# EAGLE design REALcontrol_boardv22 (EAGLE 9.6.2)
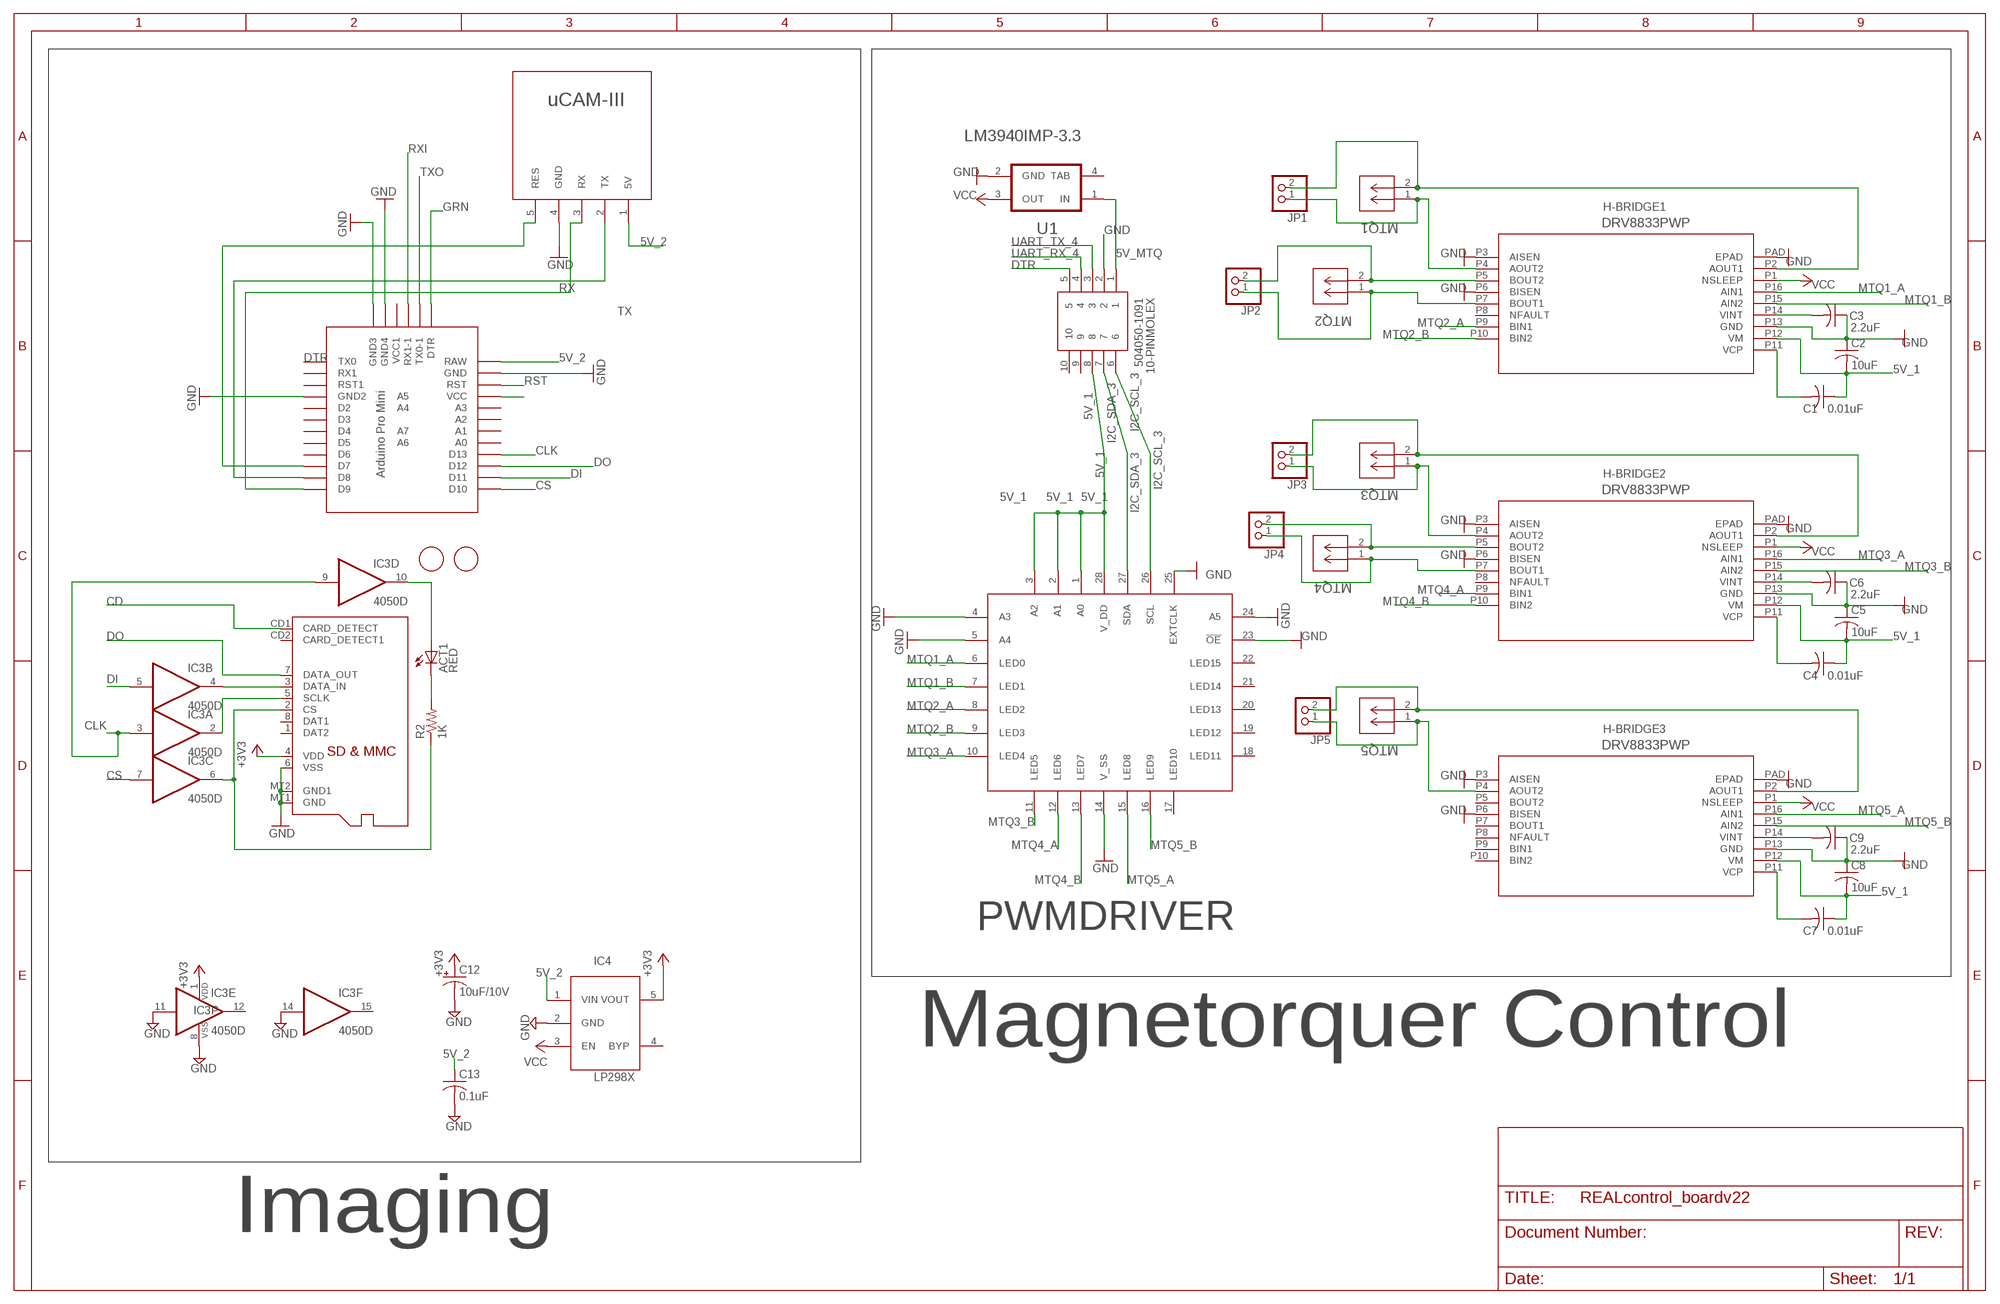
[diagram p0: schematic, sheet 1]

## Parts
10-PINMOLEX  504050-1091  [504050-1091]
ACT1  RED  LEDCHIP-LED0805  [CHIP-LED0805]
C1  0.01uF  C-USC0603K  [C0603K]
C2  10uF  C-USC1210K  [C1210K]
C3  2.2uF  C-USC0603K  [C0603K]
C4  0.01uF  C-USC0603K  [C0603K]
C5  10uF  C-USC1210K  [C1210K]
C6  2.2uF  C-USC0603K  [C0603K]
C7  0.01uF  C-USC0603K  [C0603K]
C8  10uF  C-USC1210K  [C1210K]
C9  2.2uF  C-USC0603K  [C0603K]
C12  10uF/10V  CPOL-USA/3216-18R  [A/3216-18R]
C13  0.1uF  C-USC0805K  [C0805K]
H-BRIDGE1  DRV8833PWP  [HTSSOP16]
H-BRIDGE2  DRV8833PWP  [HTSSOP16]
H-BRIDGE3  DRV8833PWP  [HTSSOP16]
IC3  4050D  [SO16]
IC4  LP298XS  [SOT23-5L]
JP1  PINHD-1X2  [1X02]
JP2  PINHD-1X2  [1X02]
JP3  PINHD-1X2  [1X02]
JP4  PINHD-1X2  [1X02]
JP5  PINHD-1X2  [1X02]
MTQ1  DF13C-2P-1.25V(51)  [CON2_1X2_U_DF13]
MTQ2  DF13C-2P-1.25V(51)  [CON2_1X2_U_DF13]
MTQ3  DF13C-2P-1.25V(51)  [CON2_1X2_U_DF13]
MTQ4  DF13C-2P-1.25V(51)  [CON2_1X2_U_DF13]
MTQ5  DF13C-2P-1.25V(51)  [CON2_1X2_U_DF13]
PWMDRIVER  PCA9685PW  [TSSOP28]
R2  1K  R-US_R0805  [R0805]
U1  TI_NATIONAL_SEMICONDUCTOR_LM3940IMP-3.3TI_NATIONAL_SEMICONDUCTOR_LM3940IMP-3.3_0_1  [TI_NATIONAL_SEMICONDUCTOR_LM3940IMP-3.3_1]
U$2  UCAM-III  [UCAM-III]
U$6  FIDUCIAL  [FIDUCIAL_1MM]
U$7  FIDUCIAL  [FIDUCIAL_1MM]
U$8  PRO-MINI-2  [PRO-MINI-2]
X2  MICROSD  [MICROSD]

## Nets
5V_1 [New Class]: 10-PINMOLEX.8 C1.1 C2.2 C4.1 C5.2 C7.1 C8.2 H-BRIDGE1.P12(VM) H-BRIDGE2.P12(VM) H-BRIDGE3.P12(VM) PWMDRIVER.1(A0) PWMDRIVER.2(A1) PWMDRIVER.3(A2) PWMDRIVER.28(V_DD)
5V_2 [New Class]: C13.1 IC4.1(VIN) U$2.1(5V) U$8.RAW
5V_MTQ [New Class]: 10-PINMOLEX.1 U1.1(IN)
+3V3: C12.+ IC3.1(P:VDD) IC4.5(VOUT) X2.4(VDD)
CD: X2.CD1(CARD_DETECT)
CLK: IC3.3(A:I) IC3.9(D:I) U$8.D13
CS: IC3.7(C:I) U$8.D10
DI: IC3.5(B:I) U$8.D11
DO: U$8.D12 X2.7(DATA_OUT)
DTR: 10-PINMOLEX.5
GND [MTQs]: 10-PINMOLEX.2 C2.1 C3.1 C5.1 C6.1 C8.1 C9.1 C12.- C13.2 H-BRIDGE1.P3(AISEN) H-BRIDGE1.P6(BISEN) H-BRIDGE1.P13(GND) H-BRIDGE1.PAD(EPAD) H-BRIDGE2.P3(AISEN) H-BRIDGE2.P6(BISEN) H-BRIDGE2.P13(GND) H-BRIDGE2.PAD(EPAD) H-BRIDGE3.P3(AISEN) H-BRIDGE3.P6(BISEN) H-BRIDGE3.P13(GND) H-BRIDGE3.PAD(EPAD) IC3.8(P:VSS) IC3.11(E:I) IC3.14(F:I) IC4.2(GND) PWMDRIVER.4(A3) PWMDRIVER.5(A4) PWMDRIVER.14(V_SS) PWMDRIVER.23(!OE) PWMDRIVER.24(A5) PWMDRIVER.25(EXTCLK) U1.2(GND) U$2.4(GND) U$8.GND U$8.GND1(GND2) U$8.GND2(GND3) U$8.GND3(GND4) X2.6(VSS) X2.MT1(GND) X2.MT2(GND1)
GRN: U$8.DTR
I2C_SCL_3: 10-PINMOLEX.6 PWMDRIVER.26(SCL)
I2C_SDA_3: 10-PINMOLEX.7 PWMDRIVER.27(SDA)
MTQ1_A: H-BRIDGE1.P16(AIN1) PWMDRIVER.6(LED0)
MTQ1_B: H-BRIDGE1.P15(AIN2) PWMDRIVER.7(LED1)
MTQ2_A: H-BRIDGE1.P9(BIN1) PWMDRIVER.8(LED2)
MTQ2_B: H-BRIDGE1.P10(BIN2) PWMDRIVER.9(LED3)
MTQ3_A: H-BRIDGE2.P16(AIN1) PWMDRIVER.10(LED4)
MTQ3_B: H-BRIDGE2.P15(AIN2) PWMDRIVER.11(LED5)
MTQ4_A: H-BRIDGE2.P9(BIN1) PWMDRIVER.12(LED6)
MTQ4_B: H-BRIDGE2.P10(BIN2) PWMDRIVER.13(LED7)
MTQ5_A: H-BRIDGE3.P16(AIN1) PWMDRIVER.15(LED8)
MTQ5_B: H-BRIDGE3.P15(AIN2) PWMDRIVER.16(LED9)
N$1 [MTQs]: H-BRIDGE2.P2(AOUT1) JP3.2 MTQ3.2
N$2: C3.2 H-BRIDGE1.P14(VINT)
N$3 [MTQs]: H-BRIDGE1.P4(AOUT2) JP1.1 MTQ1.1
N$4 [MTQs]: H-BRIDGE1.P2(AOUT1) JP1.2 MTQ1.2
N$5 [MTQs]: H-BRIDGE1.P7(BOUT1) JP2.1 MTQ2.1
N$6 [MTQs]: H-BRIDGE1.P5(BOUT2) JP2.2 MTQ2.2
N$7: C1.2 H-BRIDGE1.P11(VCP)
N$8 [MTQs]: H-BRIDGE2.P7(BOUT1) JP4.1 MTQ4.1
N$9 [MTQs]: H-BRIDGE2.P5(BOUT2) JP4.2 MTQ4.2
N$10: C6.2 H-BRIDGE2.P14(VINT)
N$11: C4.2 H-BRIDGE2.P11(VCP)
N$12 [MTQs]: H-BRIDGE2.P4(AOUT2) JP3.1 MTQ3.1
N$13 [MTQs]: H-BRIDGE3.P2(AOUT1) JP5.2 MTQ5.2
N$16: C9.2 H-BRIDGE3.P14(VINT)
N$17: C7.2 H-BRIDGE3.P11(VCP)
N$18 [MTQs]: H-BRIDGE3.P4(AOUT2) JP5.1 MTQ5.1
N$21: U$8.VCC
N$22: ACT1.A IC3.10(D:O)
N$23: IC3.2(A:O) X2.5(SCLK)
N$24: IC3.6(C:O) R2.1 X2.2(CS)
N$25: ACT1.C R2.2
N$26: IC3.4(B:O) X2.3(DATA_IN)
N$27: U$2.5(RES) U$8.D7
RST: U$8.RST
RX: U$2.3(RX) U$8.D9
RXI: U$8.RX1-1
TX: U$2.2(TX) U$8.D8
TXO: U$8.TX0-1
UART_RX_4: 10-PINMOLEX.4
UART_TX_4: 10-PINMOLEX.3
VCC: H-BRIDGE1.P1(NSLEEP) H-BRIDGE2.P1(NSLEEP) H-BRIDGE3.P1(NSLEEP) IC4.3(EN) U1.3(OUT)
Unconnected: 10-PINMOLEX.9 10-PINMOLEX.10 H-BRIDGE1.P8(NFAULT) H-BRIDGE2.P8(NFAULT) H-BRIDGE3.P5(BOUT2) H-BRIDGE3.P7(BOUT1) H-BRIDGE3.P8(NFAULT) H-BRIDGE3.P9(BIN1) H-BRIDGE3.P10(BIN2) IC3.12(E:O) IC3.15(F:O) IC4.4(BYP) PWMDRIVER.17(LED10) PWMDRIVER.18(LED11) PWMDRIVER.19(LED12) PWMDRIVER.20(LED13) PWMDRIVER.21(LED14) PWMDRIVER.22(LED15) U$8.A0 U$8.A1 U$8.A2 U$8.A3 U$8.A4 U$8.A5 U$8.A6 U$8.A7 U$8.D2 U$8.D3 U$8.D4 U$8.D5 U$8.D6 U$8.RST1 U$8.RX1 U$8.TX0 U$8.VCC1 X2.1(DAT2) X2.8(DAT1) X2.CD2(CARD_DETECT1)

## Notes on the sheet
- Magnetorquer Control
- Imaging

## Power pins joined to a net without a drawn wire
TAB: U1.4(TAB)

## Library data of the parts
10-PINMOLEX = molex_10pin:504050-1091: Pico-Lock SMT Wire-to-Board Header 10way Molex 504050 Series, 1.5mm Pitch 10 Way 1 Row Right Angle PCB Header, SMT Termination, 3A Source: Datasheet <https://componentsearchengine.com/Datasheets/1/504050-1091.pdf>; DESCRIPTION: Pico-Lock SMT Wire-to-Board Header 10way Molex 504050 Series, 1.5mm Pitch 10 Way 1 Row Right Angle PCB Header, SMT Termination, 3A; HEIGHT: mm; MANUFACTURER_NAME: Molex; MANUFACTURER_PART_NUMBER: 504050-1091; MOUSER_PART_NUMBER: 538-504050-1091; MOUSER_PRICE-STOCK: https://www.mouser.com/Search/Refine.aspx?Keyword=538-504050-1091; OC_NEWARK: unknown
ACT1 = adafruit:LED: LED OSRAM: - CHIPLED LG R971, LG N971, LY N971, LG Q971, LY Q971, LO R971, LY R971 LH N974, LH R974 LS Q976, LO Q976, LY Q976 LO Q996 - Hyper CHIPLED LW Q18S LB Q993, LB Q99A, LB R99A - SideLED LS A670, LO A670, LY A670, LG A670, LP A670 LB A673, LV A673, LT A673, LW A673 LH A674 LY A675 LS A676, LA A676, LO A676, LY A676, LW A676 LS A679, LY A679, LG A679 - Hyper Micro SIDELED® LS Y876, LA Y876, LO Y876, LY Y876 LT Y87S - SmartLED LW L88C, LW L88S LB L89C, LB L89S, LG L890 LS L89K, LO L89K, LY L89K LS L896, LA L896, LO L896, LY L896 - TOPLED LS T670, LO T670, LY T670, LG T670, LP T670 LSG T670, LSP T670, LSY T670, LOP T670, LYG T670 LG T671, LOG T671, LSG T671 LB T673, LV T673, LT T673, LW T673 LH T674 LS T676, LA T676, LO T676, LY T676, LB T676, LH T676, LSB T676, LW T676 LB T67C, LV T67C, LT T67C, LS T67K, LO T67K, LY T67K, LW E67C LS E67B, LA E67B, LO E67B, LY E67B, LB E67C, LV E67C, LT E67C LW T67C LS T679, LY T679, LG T679 LS T770, LO T770, LY T770, LG T770, LP T770 LB T773, LV T773, LT T773, LW T773 LH T774 LS E675, LA E675, LY E675, LS T675 LS T776, LA T776, LO T776, LY T776, LB T776 LHGB T686 LT T68C, LB T68C - Hyper Mini TOPLED® LB M676 - Mini TOPLED Santana® LG M470 LS M47K, LO M47K, LY M47K Source: http://www.osram.convergy.de/; OC_NEWARK: unknown
C1-C9 = rcl:C-US: CAPACITOR, American symbol; OC_NEWARK: unknown; SPICEPREFIX: C
C12 = adafruit:CPOL-US: POLARIZED CAPACITOR, American symbol; OC_NEWARK: unknown
C13 = adafruit:C-US: CAPACITOR, American symbol; OC_NEWARK: unknown
H-BRIDGE1-H-BRIDGE3 = myparts:DRV8833PWP; OC_NEWARK: unknown
IC3 = 40xx:4050: Hex non-inverting BUFFER; OC_NEWARK: unknown
IC4 = adafruit:LP298X; OC_NEWARK: unknown
JP1-JP5 = pinhead:PINHD-1X2: PIN HEADER; MF: MOLEX; MPN: 22-11-2022; OC_NEWARK: 55H9825
MTQ1-MTQ5 = myparts:DF13C-2P-1.25V(51); BUILT_BY: EMA_UL_Team; MANUFACTURER_PART_NUMBER: DF13C-2P-1.25V(51); OC_NEWARK: unknown; VENDOR: Hirose
PWMDRIVER = myparts:PCA9685PW; OC_NEWARK: unknown
R2 = adafruit:R-US_: RESISTOR, American symbol; OC_NEWARK: unknown
U1 = TI National Semiconductor - LM3940IMP-3.3:TI_NATIONAL_SEMICONDUCTOR_LM3940IMP-3.3: PM-REG-LM2940-TO4; CIIVA_IDS: 1170636; CODE__IPC: SOT223-4; CODE__JEDEC: TO-261-AA; COMPONENT_LINK_1_DESCRIPTION: Datasheet URL; COMPONENT_LINK_1_URL: http://www.ti.com/general/docs/lit/getliterature.tsp?genericPartNumber=LM3940&fileType=pdf; COMP_TYPE: LDO IC; FOOTPRINT_VARIANT_NAME_0: Level C; FOOTPRINT_VARIANT_NAME_1: Level B; FOOTPRINT_VARIANT_NAME_2: Level A; IMPORTED: yes; IMPORTED_FROM: vault; IMPORT_TS: 1521848719; MF: TI National Semiconductor; MPN: LM3940IMP-3.3; PACKAGE: DCY0004A; PACKAGE_DESCRIPTION: Molded SOT-223, 6.50 x 3.56 x 1.6mm Body, 4 Lead, 2.3mm Pitch; PACKAGE_TOP_MARKING: XYTT*L52B; PIN_COUNT: 4; POWER_WISE: N; PREFIX: U; RELEASE_DATE: 1464091660; ROHS: No; VAULT_GUID: 7D174BE9-4519-4BE6-B3E4-802F171613CA; VAULT_REVISION: 33897558-4D8B-46BE-97DA-B950EC492A4C
U$2 = myparts:UCAM-III; OC_NEWARK: unknown
U$6 U$7 = adafruit:FIDUCIAL: For use by pick and place machines to calibrate the vision/machine, 1mm By microbuilder.eu; OC_NEWARK: unknown
U$8 = myparts:PRO-MINI-2: Arduino Pro Mini Layout 2 Sparkfun.com; OC_NEWARK: unknown
X2 = adafruit:MICROSD: Micro-SD / Transflash card holder with SPI pinout For the 3M # 2908-05WB-MG and/or 4UCON #19656 push-push type; OC_NEWARK: unknown

## Net classes
0 default: width 0.152 mm
1 New Class: width 0.457 mm
2 MTQs: width 0.305 mm

## Board
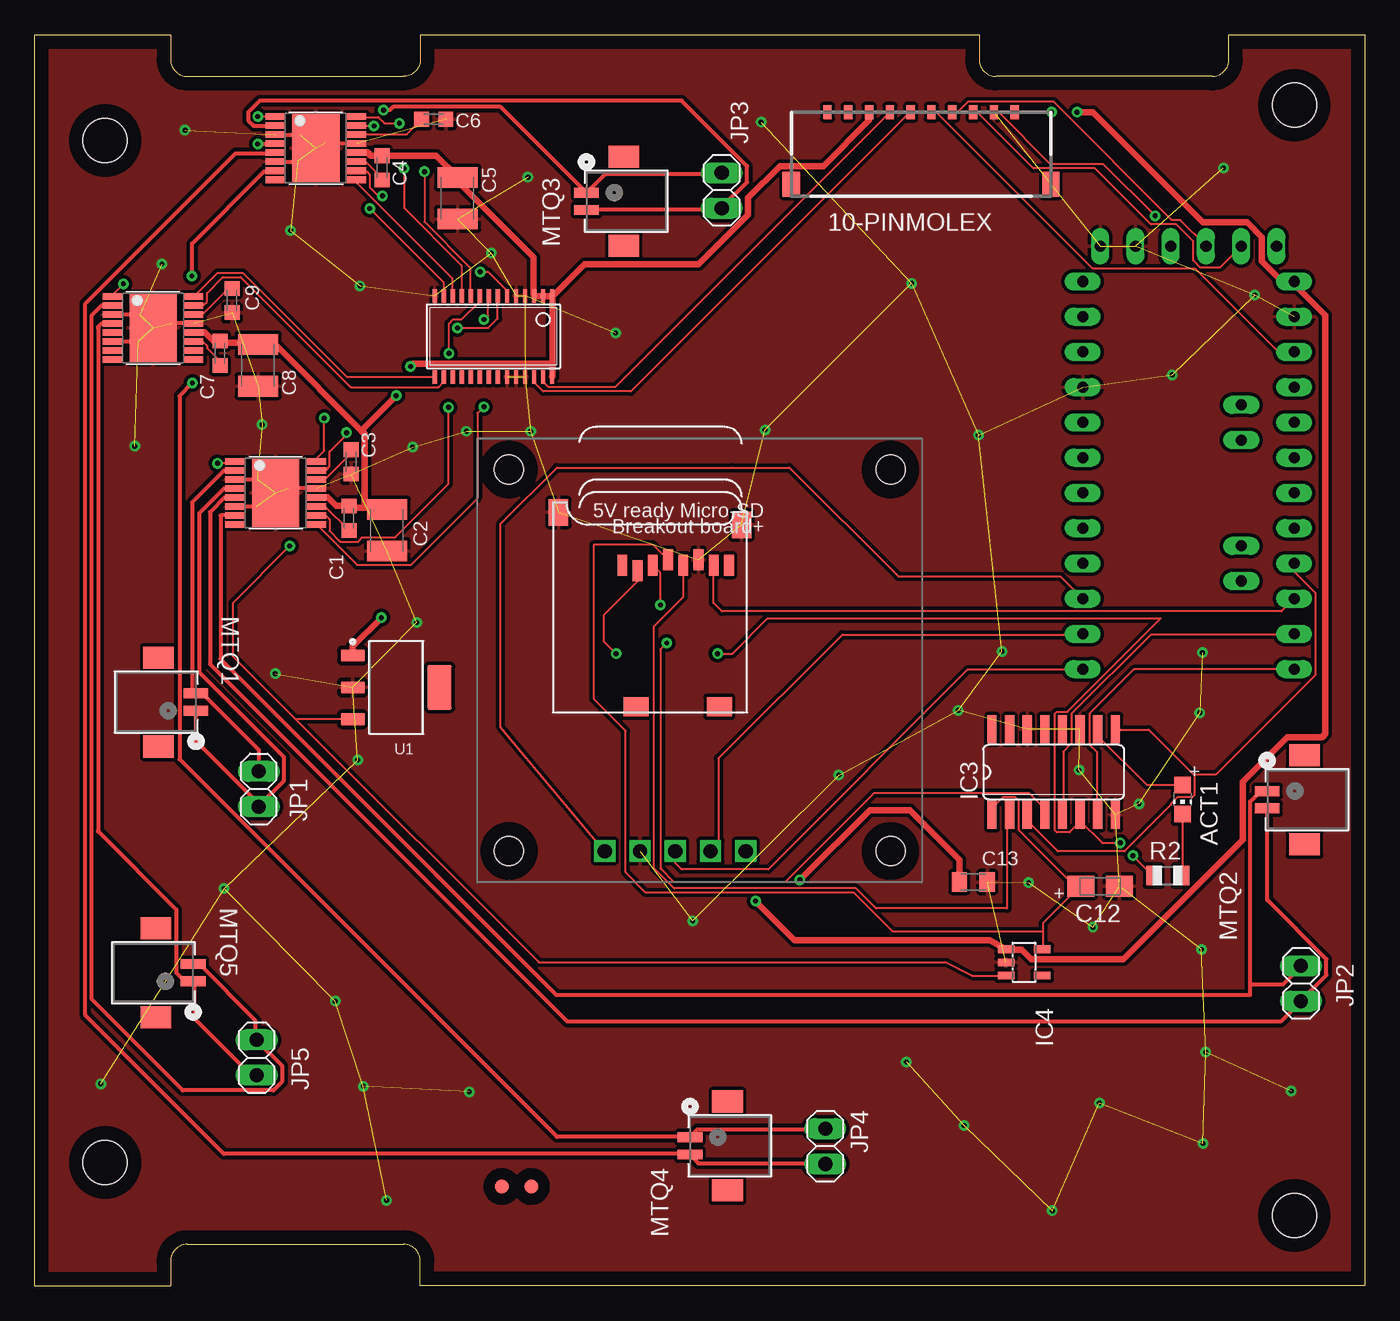
[diagram p1: board, top side]
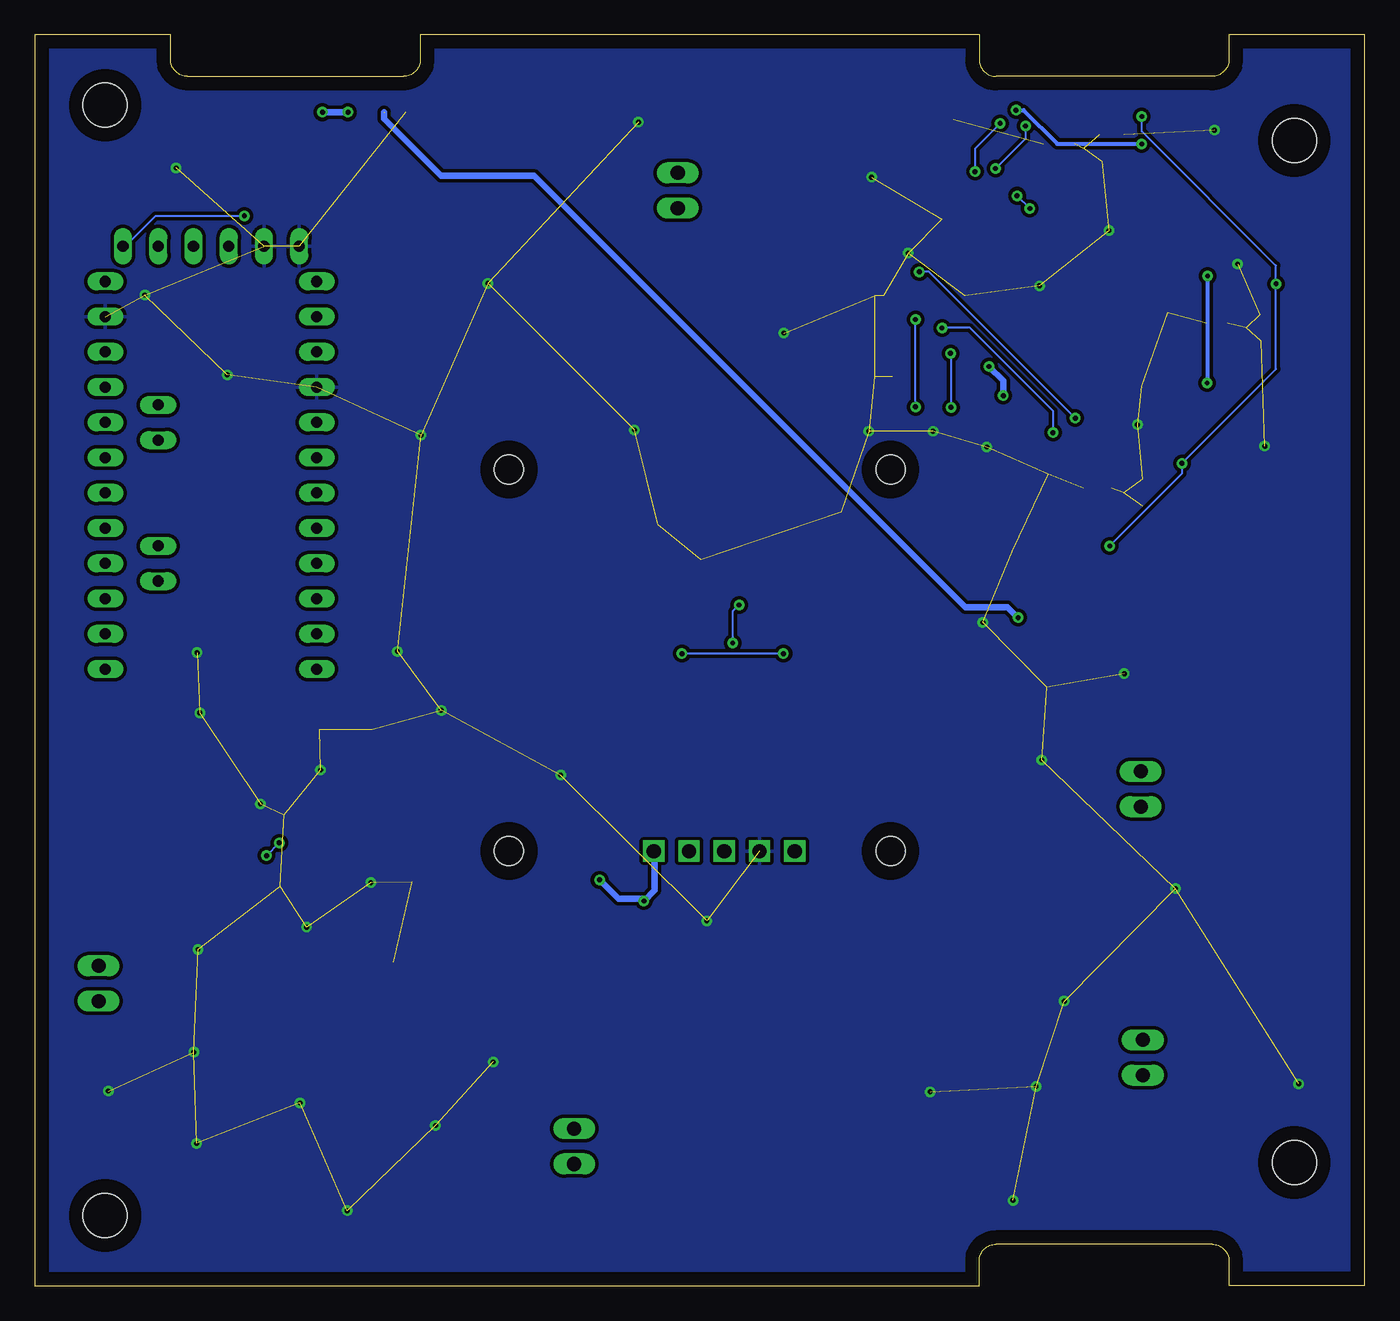
[diagram p2: board, bottom side, seen from below]

Size 95.89 x 90.17 mm. Coordinates in mm from the lower left corner, seen from the top.
Outline: 27.8,0 27.8,1.8 arc90 26.6,3 11,3 arc90 9.8,1.8 9.8,0 0,0 0,90.17 9.8,90.17 9.8,88.37 arc90 11,87.17 26.6,87.17 arc90 27.8,88.37 27.8,90.17 68.09,90.17 68.09,88.37 arc90 69.29,87.17 84.89,87.17 arc90 86.09,88.37 86.09,90.17 95.89,90.17 95.89,0 27.8,0
Copper layers (1*16): Top 0.035mm / dielectric 1.5mm / Bottom 0.035mm
Design rules "default": minimum track width 6mil, minimum drill 0.35mm, track to track 6mil, track to pad 6mil, pad to pad 6mil, via to via 6mil, smd to smd 6mil, copper to edge 40mil, drill to drill 6mil, minimum pad ring 10mil, minimum via ring 8mil, stop-mask expansion 4mil, vias tented up to drill 0mil, thermal gap 10mil
Holes 3.17 mm at 5.08,82.55 5.08,8.89 90.81,5.08 90.81,85.09

### Footprints (pad centres in the part's own frame; a part is rotated, then mirrored left to right if it is on the bottom)
504050-1091 = smd 0.6 x 1: 1 -13.5,0; 2 -12,0; 3 -10.5,0; 4 -9,0; 5 -7.5,0; 6 -6,0; 7 -4.5,0; 8 -3,0; 9 -1.5,0; 10 0,0 | smd 1.25 x 1.8: 11 2.605,5.19; 12 -16.105,5.19
CHIP-LED0805 = smd 1.2 x 1.2: A 0,-1.05; C 0,1.05
C0603K = smd 1.05 x 1.08: 1 -0.875,0; 2 0.875,0
C1210K = smd 1.5 x 2.9: 1 -1.5,0; 2 1.5,0
A/3216-18R = smd 1.95 x 1.5: + 1.375,0; - -1.375,0
C0805K = smd 1.1 x 1.4: 1 -1,0; 2 1,0
HTSSOP16 = smd 1.5 x 0.45: P1 -2.9,2.275; P2 -2.9,1.625; P3 -2.9,0.975; P4 -2.9,0.325; P5 -2.9,-0.325; P6 -2.9,-0.975; P7 -2.9,-1.625; P8 -2.9,-2.275; P9 2.9,-2.275; P10 2.9,-1.625; P11 2.9,-0.975; P12 2.9,-0.325; P13 2.9,0.325; P14 2.9,0.975; P15 2.9,1.625; P16 2.9,2.275 | smd 3.4 x 5: PAD 0,0
SO16 = smd 0.66 x 2.032: 1 -4.445,-3.073; 2 -3.175,-3.073; 3 -1.905,-3.073; 4 -0.635,-3.073; 5 0.635,-3.073; 6 1.905,-3.073; 7 3.175,-3.073; 8 4.445,-3.073; 9 4.445,3.073; 10 3.175,3.073; 11 1.905,3.073; 12 0.635,3.073; 13 -0.635,3.073; 14 -1.905,3.073; 15 -3.175,3.073; 16 -4.445,3.073
SOT23-5L = smd 0.55 x 1.2: 1 -0.95,-1.3; 2 0,-1.3; 3 0.95,-1.3; 4 0.95,1.3; 5 -0.95,1.3
1X02 = drill 1.016 long: 1 -1.27,0; 2 1.27,0
CON2_1X2_U_DF13 = smd 0.711 x 1.778: 1 0,0; 2 -1.25,0 | smd 1.6 x 2.21: 3 -3.825,-2.7; 5 2.575,-2.7
TSSOP28 = smd 0.305 x 0.991: 1 -4.225,-2.918; 2 -3.575,-2.918; 3 -2.925,-2.918; 4 -2.275,-2.918; 5 -1.625,-2.918; 6 -0.975,-2.918; 7 -0.325,-2.918; 8 0.325,-2.918; 9 0.975,-2.918; 10 1.625,-2.918; 11 2.275,-2.918; 12 2.925,-2.918; 13 3.575,-2.918; 14 4.225,-2.918; 15 4.225,2.918; 16 3.575,2.918; 17 2.925,2.918; 18 2.275,2.918; 19 1.625,2.918; 20 0.975,2.918; 21 0.325,2.918; 22 -0.325,2.918; 23 -0.975,2.918; 24 -1.625,2.918; 25 -2.275,2.918; 26 -2.925,2.918; 27 -3.575,2.918; 28 -4.225,2.918
R0805 = smd 1.1 x 1.4: 1 -1,0; 2 1,0
TI_NATIONAL_SEMICONDUCTOR_LM3940IMP-3.3_1 = smd 1.75 x 0.9: 1 -3.125,2.3; 2 -3.125,0; 3 -3.125,-2.3 | smd 1.75 x 3.2: 4 3.125,0
UCAM-III = drill 1.02 square: 1 19.31,2.25; 2 16.77,2.25; 3 14.23,2.25; 4 11.69,2.25; 5 9.15,2.25 | hole 2.1: 2.25,2.25; 29.75,2.25; 29.75,29.75; 2.25,29.75
FIDUCIAL_1MM = smd 1 x 1: 1 0,0
PRO-MINI-2 = drill 0.8 long: A0 6.35,2.54; A1 6.35,0; A2 6.35,-2.54; A3 6.35,-5.08; A4 2.54,1.27; A5 2.54,3.81; A6 2.54,-8.89; A7 2.54,-6.35; D2 -8.89,2.54; D3 -8.89,0; D4 -8.89,-2.54; D5 -8.89,-5.08; D6 -8.89,-7.62; D7 -8.89,-10.16; D8 -8.89,-12.7; D9 -8.89,-15.24; D10 6.35,-15.24; D11 6.35,-12.7; D12 6.35,-10.16; D13 6.35,-7.62; DTR 5.08,15.24; GND 6.35,10.16; GND1 -8.89,5.08; GND2 -7.62,15.24; GND3 -5.08,15.24; RAW 6.35,12.7; RST 6.35,7.62; RST1 -8.89,7.62; RX1 -8.89,10.16; RX1-1 0,15.24; TX0 -8.89,12.7; TX0-1 2.54,15.24; VCC 6.35,5.08; VCC1 -2.54,15.24
MICROSD = smd 0.7 x 1.5: 1 9,-10.64; 2 7.9,-10.24; 3 6.8,-10.64; 4 5.7,-11.04; 5 4.6,-10.64; 6 3.5,-11.04; 7 2.4,-10.64; 8 1.3,-10.64 | smd 1.8 x 1.4: CD1 2,-0.44; CD2 8,-0.44 | smd 1.4 x 1.9: MT1 0.4,-13.54; MT2 13.6,-14.44

### Placement (x,y rotation side)
10-PINMOLEX  57.15,84.58 180 top
ACT1  82.75,35.05 180 top
C1  22.66,55.32 270 top
C2  25.4,54.46 90 top
C3  22.81,59.39 90 top
C4  25.04,80.57 270 top
C5  30.48,78.38 90 top
C6  28.77,84.07 180 top
C7  13.36,67.21 270 top
C8  16.1,66.34 90 top
C9  14.22,71.02 90 top
C12  76.81,28.8 180 top
C13  67.67,29.11 0 top
H-BRIDGE1  17.37,57.15 0 top
H-BRIDGE2  20.27,81.99 0 top
H-BRIDGE3  8.53,69.04 0 top
IC3  73.46,37.03 0 top
IC4  71.32,23.32 270 top
JP1  16.15,35.81 90 top
JP2  91.29,21.79 270 top
JP3  49.53,78.94 270 top
JP4  57,10.06 270 top
JP5  16,16.46 90 top
MTQ1  11.63,41.45 270 top
MTQ2  88.85,35.66 90 top
MTQ3  39.78,78.79 90 top
MTQ4  47.24,10.72 90 top
MTQ5  11.43,21.95 270 top
PWMDRIVER  33.07,68.43 180 top
R2  81.69,29.57 0 top
U1  26.06,43.13 0 top
U$2  31.95,29.09 0 top
U$6  33.68,7.16 0 top
U$7  35.81,7.16 0 top
U$8  84.44,59.69 0 top
X2  51.36,41.3 180 top

### Tracks (layer width: path | path; a pad name or v marks a point on that pad's centre or on a via)
5V_1  (via drill 0.35)
  Top 0.457: H-BRIDGE3.P12 11.51,68.73 12.27,68.73 12.88,68.12 13.34,68.12 C7.1 13.56,67.97 16,67.97 16.08,67.89 C8.2 16.31,67.74 17.45,67.74 23.55,61.65 | H-BRIDGE1.P12 20.34,56.84 21.11,56.84 21.72,56.24 22.63,56.24 C1.1 22.86,56.08 23.77,56.08 | 23.77,56.08 25.3,56.08 25.38,56.01 C2.2 | 23.55,61.65 23.77,61.42 23.77,56.08 | H-BRIDGE2.P12 23.24,81.69 24,81.69 24.23,81.46 24.99,81.46 C4.1 25.22,81.46 28.96,81.46 30.48,79.93 C5.2 30.56,79.7 30.56,79.55 35.97,74.14 35.97,71.55 PWMDRIVER.3 36.04,71.32 36.58,71.32 PWMDRIVER.2 36.88,71.32 37.11,71.32 PWMDRIVER.1 37.34,71.32 | 37.34,71.32 37.34,66.45 | 37.34,71.32 39.62,73.61 47.85,73.61 51.44,77.19 51.44,78.41 53.72,80.7 56.84,80.7 60.15,84 10-PINMOLEX.8 | v26.06,64.16 23.55,61.65 | v27.1,66.26 27.29,66.45 37.34,66.45 | 37.34,66.45 37.34,65.55 PWMDRIVER.28
  Bottom 0.457: v27.1,66.26 26.06,65.22 v26.06,64.16
5V_2  (via drill 0.35)
  Top 0.457: v51.97,27.74 54.79,24.92 68.88,24.92 IC4.1 70.26,24.23 71.17,24.23 71.86,23.55 78.49,23.55 87.1,32.16 87.1,36.35 90.3,39.55 92.81,39.55 93.04,39.78 93.04,69.95 90.83,72.16 U$8.RAW 90.75,72.39 89.92,72.39 88.47,73.84 88.47,75.59 87.4,76.66 84.2,76.66 76.28,84.58 v75.13,84.58 | C13.1 66.67,30.72 63.09,34.29 60.2,34.29 v55.17,29.26
  Bottom 0.457: v55.17,29.26 53.8,27.89 52.12,27.89 v51.97,27.74 51.21,28.5 51.21,31.29 U$2.1 | v75.13,84.58 v73.3,84.58
5V_MTQ  (via drill 0.35)  (1 unrouted)
  Top 0.457: U1.1 22.93,46.1 v24.99,48.16
  Bottom 0.457: v24.99,48.16 25.76,48.92 28.8,48.92 59.89,80.01 66.6,80.01 70.71,84.12 70.71,84.58
+3V3
  Top 0.152: 72.69,25.53 72.69,26.14 75.36,28.8 C12.+ 75.13,28.65 70.94,32.84 70.94,34.98 70.71,35.2 69.8,35.2 69.04,34.44 69.04,33.98 IC3.1 | 72.69,25.53 72.69,24.31 IC4.5 | 72.69,25.53 61.87,25.53 59.05,28.35 44.04,28.35 42.6,29.79 42.6,40.01 40.31,42.29 40.31,53.41 44.59,53.41 X2.4
CLK
  Top 0.152: IC3.3 71.55,33.53 73.76,31.32 78.56,31.32 81.92,34.67 81.92,34.75 82.37,35.2 83.44,35.2 83.59,35.36 83.59,36.8 83.55,36.84 | 83.55,36.84 80.31,40.08 77.95,40.08 IC3.9 | U$8.D13 90.83,52.05 90.83,51.44 92.35,49.91 92.35,44.04 85.19,36.88 83.59,36.88 83.55,36.84
CS
  Top 0.152: IC3.7 76.58,33.98 76.58,38.48 76.05,39.01 76.05,41.22 79.25,44.42 90.75,44.42 U$8.D10
DI
  Top 0.152: IC3.5 74.14,33.98 74.14,38.48 74.75,39.09 74.75,41.22 80.47,46.94 90.75,46.94 U$8.D11
DO
  Top 0.152: U$8.D12 89.88,48.61 49.53,48.61 48.92,49.23 48.92,51.9 X2.7
GND  (via drill 0.35)  (85 unrouted)
  Top 0.305: H-BRIDGE3.P3 7.57,70.01 7.58,70 | H-BRIDGE3.P6 7.46,68.06 7.47,68.07 | H-BRIDGE3.P13 9.91,69.36 9.9,69.37 | H-BRIDGE2.P3 19.13,82.97 | H-BRIDGE2.P6 18.95,81.02 18.96,81.03 | H-BRIDGE2.P13 20.95,82.32 20.93,82.34 | H-BRIDGE1.P3 16.03,58.12 16.04,58.14 | H-BRIDGE1.P6 15.97,56.17 15.99,56.2 | H-BRIDGE1.P13 18.28,57.48 18.26,57.49
  other vias: 10.84,83.29 18.44,76.06 9.17,73.64 7.22,60.52 23.45,72.07 16.39,62.06 17.34,44.13 23.29,37.9 27.53,47.81 35.75,61.59 31.12,61.59 27.25,60.46 35.56,79.9 32.92,74.43 52.36,83.87 41.88,68.67 52.65,61.69 63.22,72.26 68.03,61.31 82.01,65.65 85.69,80.57 87.95,71.41 84.18,45.64 83.99,41.3 69.74,45.74 66.59,41.48 57.97,36.82 71.65,29.06 79.61,34.75 76.28,25.85 84.12,24.25 47.44,26.31 62.83,16.14 67,11.56 73.36,5.43 76.75,13.19 84.42,16.85 84.22,10.27 90.58,14.04 13.64,28.64 21.67,20.52 23.7,14.38 31.33,13.99 25.36,6.17 4.77,14.56 75.29,37.19
  pour Top (isolate 0.254): -3.17,94.42 95.66,94.42 103.89,86.19 103.89,-9.91 103.14,-10.66 -0.93,-10.66 -8.04,-3.56 -8.04,89.56
  pour Bottom (isolate 0.254): -4.42,97.86 98.31,97.86 110.08,86.09 110.08,3.18 91.94,-14.96 8.1,-14.96 -15.94,9.07 -15.94,86.34
GRN  (via drill 0.35)
  Top 0.152: 69.49,84.58 73.23,80.85 77.04,80.85 v80.77,77.11
  Bottom 0.152: v80.77,77.11 87.17,77.11 89.31,74.98 89.46,74.98 U$8.DTR
I2C_SCL_3
  Top 0.152: PWMDRIVER.26 36.04,65.46 36.04,65.08 36.65,64.47 42.98,64.47 63.09,84.58 10-PINMOLEX.6
I2C_SDA_3
  Top 0.152: PWMDRIVER.27 36.65,65.46 36.65,65.15 37.03,64.77 41.83,64.77 10-PINMOLEX.7
MTQ1_A  (via drill 0.35)
  Top 0.152: v32.11,73.08 32.69,73.08 33.98,71.78 33.98,71.4 PWMDRIVER.6 | v20.88,62.54 20.88,60.2 20.34,59.66 20.34,59.44 H-BRIDGE1.P16
  Bottom 0.152: v20.88,62.54 31.42,73.08 v32.11,73.08
MTQ1_B  (via drill 0.35)
  Top 0.152: v30.48,69.04 32.69,69.04 33.38,69.72 33.38,71.32 PWMDRIVER.7 | v22.48,61.49 22.48,61.34 21.26,60.12 21.26,59.05 21.03,58.83 20.34,58.83 H-BRIDGE1.P15
  Bottom 0.152: v22.48,61.49 22.48,63.05 28.46,69.04 v30.48,69.04
MTQ2_A  (via drill 0.35)
  Top 0.152: v32.38,69.65 32.69,69.95 32.69,71.32 PWMDRIVER.8 | v32.38,63.35 31.93,62.89 31.93,56.77 27.13,51.97 23.24,51.97 20.34,54.86 H-BRIDGE1.P9
  Bottom 0.152: v32.38,63.35 v32.38,69.65
MTQ2_B  (via drill 0.35)
  Top 0.152: v29.87,67.21 29.87,69.34 30.18,69.65 30.79,69.65 32.08,70.94 32.08,71.32 PWMDRIVER.9 | v29.83,63.31 29.83,57.8 25.98,53.95 23.62,53.95 23.32,53.65 22.02,53.65 21.26,54.41 21.26,55.24 21.03,55.47 20.34,55.47 H-BRIDGE1.P10
  Bottom 0.152: v29.83,63.31 29.83,67.17 v29.87,67.21
MTQ3_A  (via drill 0.35)
  Top 0.152: v28.1,80.3 28.1,76.67 31.39,73.38 31.39,71.4 PWMDRIVER.10 | v26.29,83.78 25.23,83.78 24.77,84.24 23.2,84.24 H-BRIDGE2.P16
  Bottom 0.152: v26.29,83.78 28.1,81.97 v28.1,80.3
MTQ3_B  (via drill 0.35)
  Top 0.152: v26.62,80.53 26.62,77.7 30.79,73.53 30.79,71.4 PWMDRIVER.11 | v24.46,83.59 23.24,83.59 H-BRIDGE2.P15
  Bottom 0.152: v24.46,83.59 24.46,82.69 v26.62,80.53
MTQ4_A
  Top 0.152: PWMDRIVER.12 30.1,71.4 30.1,72.62 23.24,79.48 23.24,79.7 H-BRIDGE2.P9
MTQ4_B  (via drill 0.35)
  Top 0.152: v24.16,77.65 29.49,72.31 29.49,71.4 PWMDRIVER.13 | v25.07,78.56 24.77,78.56 24.16,79.17 24.16,80.09 23.93,80.31 23.24,80.31 H-BRIDGE2.P10
  Bottom 0.152: v25.07,78.56 v24.16,77.65
MTQ5_A
  Top 0.152: PWMDRIVER.15 28.8,65.53 22.48,65.53 15.01,73 13.18,73 11.51,71.32 H-BRIDGE3.P16
MTQ5_B
  Top 0.152: PWMDRIVER.16 29.49,65.46 29.49,65.15 29.11,64.77 22.78,64.77 14.86,72.69 13.56,72.69 12.42,71.55 12.42,70.94 12.19,70.71 11.51,70.71 H-BRIDGE3.P15
N$1
  Top 0.305: H-BRIDGE2.P2 17.3,83.59 15.77,83.59 15.39,83.97 15.39,84.58 16.23,85.42 46.63,85.42 51.36,80.7 51.36,79.55 49.53,77.72 JP3.2 49.45,77.57 39.78,77.57 MTQ3.2
N$2
  Top 0.152: C3.2 22.78,60.2 22.78,59.97 20.95,58.14 20.34,58.14 H-BRIDGE1.P14
N$3
  Top 0.305: H-BRIDGE1.P4 14.4,57.45 13.64,57.45 11.89,55.7 11.89,44.2 17.98,38.1 17.98,36.42 16.15,34.59 JP1.1 16.15,34.75 11.66,39.24 11.66,41.45 MTQ1.1
N$4
  Top 0.305: H-BRIDGE1.P2 14.4,58.75 13.64,58.75 11.35,56.46 11.35,42.98 MTQ1.2 11.81,42.75 12.04,42.75 16.15,38.63 JP1.2
N$5
  Top 0.305: H-BRIDGE1.P7 13.41,55.52 13.41,45.16 37.61,20.95 87.63,20.95 87.63,21.72 | 87.63,21.72 89.99,21.72 91.29,23.01 JP2.1 | MTQ2.1 88.39,35.66 87.63,34.9 87.63,21.72
N$6
  Top 0.305: H-BRIDGE1.P5 13.71,56.83 12.64,55.76 12.64,44.81 38.41,19.05 89.81,19.05 JP2.2 91.36,20.65 93.12,22.4 93.12,23.55 88.85,27.81 MTQ2.2
N$7
  Top 0.152: C1.2 22.63,54.48 20.95,56.16 20.34,56.16 H-BRIDGE1.P11
N$8  (via drill 0.35)
  Top 0.305: v11.34,72.78 11.34,75.12 16.54,80.31 17.3,80.31 H-BRIDGE2.P7 | v11.37,65.07 10.44,64.14 10.44,37.95 37.64,10.74 47.24,10.74 MTQ4.1 47.32,10.82 47.78,11.28 57,11.28 JP4.1
  Bottom 0.305: v11.37,65.07 11.37,72.75 v11.34,72.78
N$9
  Top 0.305: H-BRIDGE2.P5 17.3,81.61 14.48,81.61 3.66,70.79 3.66,19.51 13.64,9.53 47.24,9.53 MTQ4.2 47.32,9.37 47.85,8.84 57,8.84 JP4.2
N$10
  Top 0.152: C6.2 26.81,82.98 23.24,82.98 H-BRIDGE2.P14
N$11
  Top 0.152: C4.2 24.99,79.7 24.99,79.86 23.85,81 23.24,81 H-BRIDGE2.P11
N$12  (via drill 0.35)
  Top 0.305: v16.08,82.3 17.3,82.3 H-BRIDGE2.P4 | v25.15,84.73 25.6,84.73 25.83,84.96 33.6,84.96 MTQ3.1 41.15,80.16 49.53,80.16 JP3.1
  Bottom 0.305: v16.08,82.3 22.17,82.3 24.61,84.73 v25.15,84.73
N$13
  Top 0.305: H-BRIDGE3.P2 5.56,70.64 4.8,70.64 4.12,69.95 4.12,20.65 10.67,14.1 17.22,14.1 17.83,14.71 17.83,15.85 16,17.68 JP5.2 15.93,17.83 15.93,19.13 11.89,23.16 11.43,23.16 MTQ5.2
N$16
  Top 0.152: C9.2 14.17,71.86 13.95,71.86 12.12,70.03 11.51,70.03 H-BRIDGE3.P14
N$17
  Top 0.152: C7.2 13.34,66.37 13.34,66.67 12.42,67.59 12.42,67.74 12.12,68.05 11.51,68.05 H-BRIDGE3.P11
N$18
  Top 0.305: 4.61,69.15 4.8,69.34 5.56,69.34 H-BRIDGE3.P4 | 4.61,69.15 4.57,69.11 | JP5.1 15.6,15.19 11.51,19.28 11.51,21.87 MTQ5.1 10.82,21.95 10.21,22.55 10.21,27.13 4.57,32.77 4.58,32.77 4.58,69.05 4.61,69.08 4.61,69.15
N$22
  Top 0.152: ACT1.A 82.75,36.12 80.16,36.12 76.66,39.62 76.66,40.08 IC3.10
N$23
  Top 0.152: X2.5 46.76,49.65 44.65,47.55 44.65,30.1 46.1,28.65 59.21,28.65 60.66,27.2 70.1,27.2 70.1,33.38 70.26,33.53 70.26,33.91 IC3.2
N$24  (via drill 0.35)
  Top 0.152: v79.17,31.01 80.62,29.57 R2.1 | v78.26,31.93 76.96,31.93 75.36,33.53 IC3.6 75.36,33.45 74.6,32.69 73.69,32.69 73.53,32.84 73.53,41.22 73.69,41.38 74.45,41.38 81.15,48.08 52.81,48.08 50.29,45.57 v49.23,45.57 | X2.2 43.46,50.78 41.02,48.34 41.02,46.46 v41.91,45.57
  Bottom 0.152: v78.26,31.93 v79.17,31.01 | v41.91,45.57 v49.23,45.57
N$25
  Top 0.152: ACT1.C 82.75,29.57 R2.2
N$26  (via drill 0.35)
  Top 0.152: IC3.4 72.77,33.98 72.77,34.44 71.7,35.51 60.5,35.51 54.1,29.11 46.1,29.11 45.11,30.1 45.11,45.87 v45.57,46.33 | v45.11,49.07 45.11,51.39 X2.3
  Bottom 0.152: v45.11,49.07 45.57,48.62 v45.57,46.33
N$27
  Top 0.152: U$8.D7 73.95,51.13 62.26,51.13 54.41,58.98 50.29,58.98 | U$2.5 33.59,40.27 33.59,54.93 37.64,58.98 50.29,58.98 | 50.29,58.98
RST
  Top 0.152: 65,84.58 76.28,73.3 83.67,73.3 89.61,67.36 90.75,67.36 U$8.RST
RX
  Top 0.152: U$8.D9 75.51,44.42 67.28,44.42 52.88,30.02 46.63,30.02 46.17,30.48 U$2.3
RXI
  Top 0.152: 66.52,84.58 67.28,85.34 73.46,85.34 81.99,76.81 82.6,76.81 84.43,74.98 U$8.RX1-1
TX
  Top 0.152: U$8.D8 75.51,46.94 58.22,46.94 49.29,38.01 49.29,31.94 49.34,31.96 U$2.2
TXO
  Top 0.152: 67.97,84.58 72.01,80.54 76.43,80.54 80.47,76.5 82.3,76.5 83.52,75.29 83.52,73.91 84.05,73.38 85.42,73.38 86.94,74.91 U$8.TX0-1
VCC  (via drill 0.35)
  Top 0.152: 18.86,40.8 14.27,45.39 14.27,49.21 v18.39,53.33 | 18.86,40.8 36.35,23.32 65.66,23.32 67.57,22.37 IC4.3 | v13.18,59.28 14.33,59.28 14.4,59.36 H-BRIDGE1.P1 | v6.4,72.21 5.72,71.53 H-BRIDGE3.P1 | v16.08,84.28 17.3,84.28 H-BRIDGE2.P1 | U1.3 18.88,40.83 18.86,40.8
  Bottom 0.152: v18.39,53.33 13.18,58.53 v13.18,59.28 6.4,66.06 v6.4,72.21 6.4,73.53 16.08,83.21 v16.08,84.28

### Text on the board
tPlace: 5V ready Micro-SD | Breakout board+